# EAGLE design RobotBaseModule (EAGLE 7.3.0)
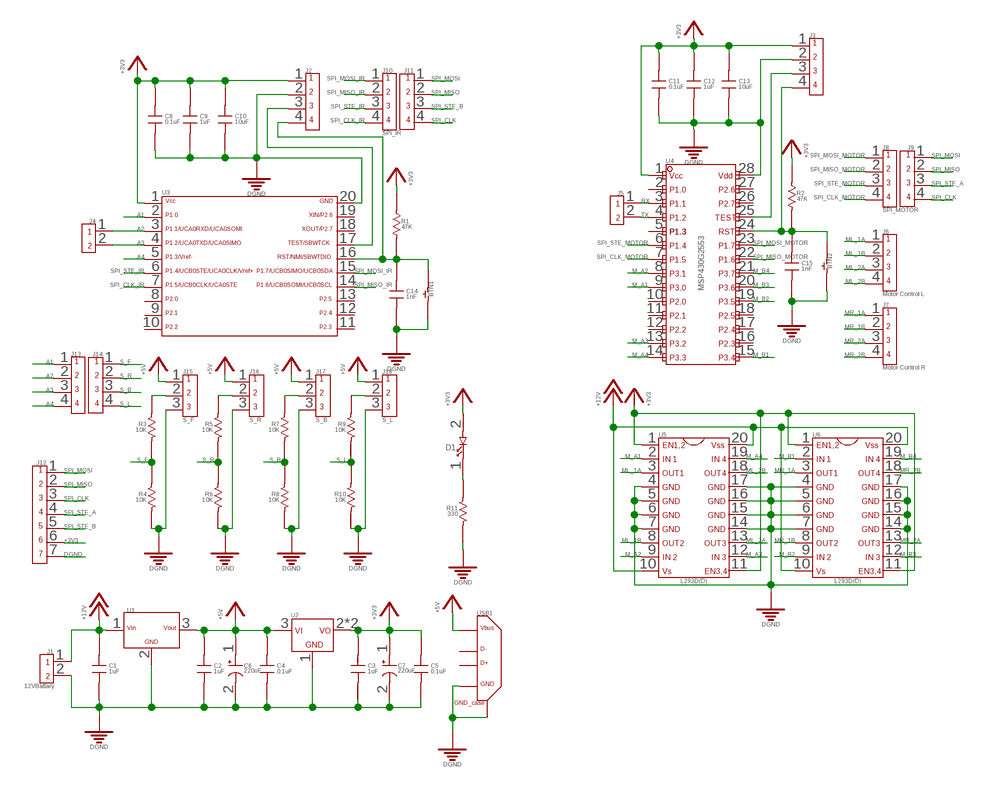
[diagram p0: schematic, sheet 1]

## Parts
BTN1  BTN_NORMAL_OFF_6_3.5_SMD  [BTN_6_3.5_SMD]
BTN2  BTN_NORMAL_OFF_6_3.5_SMD  [BTN_6_3.5_SMD]
C1  1uF  CAPACITOR_FIXED_0805  [0805]
C2  1uF  CAPACITOR_FIXED_0805  [0805]
C3  1uF  CAPACITOR_FIXED_0805  [0805]
C4  0.1uF  CAPACITOR_FIXED_0805  [0805]
C5  0.1uF  CAPACITOR_FIXED_0805  [0805]
C6  220uF  CAPACITOR_POLARIZED_830_830  [CAP_830_830]
C7  220uF  CAPACITOR_POLARIZED_830_830  [CAP_830_830]
C8  0.1uF  CAPACITOR_FIXED_0805  [0805]
C9  1uF  CAPACITOR_FIXED_0805  [0805]
C10  10uF  CAPACITOR_FIXED_0805  [0805]
C11  0.1uF  CAPACITOR_FIXED_0805  [0805]
C12  1uF  CAPACITOR_FIXED_0805  [0805]
C13  10uF  CAPACITOR_FIXED_0805  [0805]
C14  1nF  CAPACITOR_FIXED_0805  [0805]
C15  1nF  CAPACITOR_FIXED_0805  [0805]
D1  LED_0805  [0805DIODE]
J1  12VBattary  2PIN_TERMBLOCK_PITCH5.08MM  [2PIN_TERMBLOCK_PITCH5.08MM]
J2  4PIN_HEADER_VERT_PITCH2.54MM_TH  [4PIN_HEADER_VERT_PITCH2.54MM_TH]
J3  4PIN_HEADER_VERT_PITCH2.54MM_TH  [4PIN_HEADER_VERT_PITCH2.54MM_TH]
J4  2PIN_HEADER_PITCH2.54MM_TH  [2PIN_HEADER_PITCH2.54MM_TH]
J5  2PIN_HEADER_PITCH2.54MM_TH  [2PIN_HEADER_PITCH2.54MM_TH]
J6  Motor Control L  4PIN_HEADER_VERT_PITCH2.54MM_TH  [4PIN_HEADER_VERT_PITCH2.54MM_TH]
J7  Motor Control R  4PIN_HEADER_VERT_PITCH2.54MM_TH  [4PIN_HEADER_VERT_PITCH2.54MM_TH]
J8  SPI_MOTOR  4PIN_HEADER_PITCH2.54MM_TH  [4PIN_HEADER_PITCH2.54MM_TH]
J9  4PIN_HEADER_PITCH2.54MM_TH  [4PIN_HEADER_PITCH2.54MM_TH]
J10  SPI_IR  4PIN_HEADER_PITCH2.54MM_TH  [4PIN_HEADER_PITCH2.54MM_TH]
J11  4PIN_HEADER_PITCH2.54MM_TH  [4PIN_HEADER_PITCH2.54MM_TH]
J12  7PIN_HEADER_VERT_PITCH2.54MM_TH  [7PIN_HEADER_VERT_PITCH2.54MM_TH]
J13  4PIN_HEADER_PITCH2.54MM_TH  [4PIN_HEADER_PITCH2.54MM_TH]
J14  4PIN_HEADER_PITCH2.54MM_TH  [4PIN_HEADER_PITCH2.54MM_TH]
J15  S_F  3PIN_HEADER_VERT_PITCH2.54MM_TH  [3PIN_HEADER_VERT_PITCH2.54MM_TH]
J16  S_R  3PIN_HEADER_VERT_PITCH2.54MM_TH  [3PIN_HEADER_VERT_PITCH2.54MM_TH]
J17  S_B  3PIN_HEADER_VERT_PITCH2.54MM_TH  [3PIN_HEADER_VERT_PITCH2.54MM_TH]
J18  S_L  3PIN_HEADER_VERT_PITCH2.54MM_TH  [3PIN_HEADER_VERT_PITCH2.54MM_TH]
R1  47K  RESISTOR_0805  [0805]
R2  47K  RESISTOR_0805  [0805]
R3  10K  RESISTOR_0805  [0805]
R4  10K  RESISTOR_0805  [0805]
R5  10K  RESISTOR_0805  [0805]
R6  10K  RESISTOR_0805  [0805]
R7  10K  RESISTOR_0805  [0805]
R8  10K  RESISTOR_0805  [0805]
R9  10K  RESISTOR_0805  [0805]
R10  10K  RESISTOR_0805  [0805]
R11  330  RESISTOR_0805  [0805]
U1  V78-2000R  [V78-2000R]
U2  LM1117_SOT-223-4  [SOT-233-4]
U3  MSP430G2X53/G2X13_SSOP20  [SSOP-20]
U4  MSP430G2553  MSP430G2553_24IO_28PIN_TSSOP  [TSSOP-28]
U5  L293D(D)_ST_SMD  [SOIC_20]
U6  L293D(D)_ST_SMD  [SOIC_20]
USB1  USB-1.X/2.0-STANDARDTYPEA-TH  [USB-A-TH]

## Nets
+3V3: C3.1 C5.1 C7.1 C8.1 C9.1 C10.1 C11.1 C12.1 C13.1 D1.2 J2.1 J3.1 J12.6 R1.1 R2.1 U2.2(VOUT) U2.4(VOUT) U3.1 U4.1 U5.1 U5.11 U6.1 U6.11
+5V: C2.1 C4.1 C6.1 J15.1 J16.1 J17.1 J18.1 U1.3(VOUT) U2.3(VIN) USB1.1(VBUS)
+12V: C1.1 J1.1 U1.1(VIN) U5.10 U5.20 U6.10 U6.20
A1: J13.1 U3.2
A2: J4.1 J13.2 U3.3
A3: J4.2 J13.3 U3.4
A4: J13.4 U3.5
DGND: BTN1.2 BTN2.2 C1.2 C2.2 C3.2 C4.2 C5.2 C6.2 C7.2 C8.2 C9.2 C10.2 C11.2 C12.2 C13.2 C14.2 C15.2 J1.2 J2.2 J3.2 J12.7 J15.3 J16.3 J17.3 J18.3 R4.2 R6.2 R8.2 R10.2 R11.2 U1.2(GND) U2.1(GND) U3.20 U4.28 U5.4 U5.5 U5.6 U5.7 U5.14 U5.15 U5.16 U5.17 U6.4 U6.5 U6.6 U6.7 U6.14 U6.15 U6.16 U6.17 USB1.4(GND) USB1.CASE1(GND_CASE) USB1.CASE2(GND_CASE)
M_A1: U4.9 U5.2
M_A2: U4.8 U5.9
M_A3: U4.13 U5.12
M_A4: U4.14 U5.19
M_B1: U4.15 U6.2
M_B2: U4.19 U6.9
M_B3: U4.20 U6.12
M_B4: U4.21 U6.19
ML_1A: J6.1 U5.3
ML_1B: J6.2 U5.8
ML_2A: J6.3 U5.13
ML_2B: J6.4 U5.18
MR_1A: J7.1 U6.3
MR_1B: J7.2 U6.8
MR_2A: J7.3 U6.13
MR_2B: J7.4 U6.18
N$1: J3.3 U4.25
N$2: J2.3 U3.17
N$3: BTN1.1 C14.1 J2.4 R1.2 U3.16
N$4: BTN2.1 C15.1 J3.4 R2.2 U4.24
N$5: J15.2 R3.1
N$6: D1.1 R11.1
N$8: J16.2 R5.1
N$9: J17.2 R7.1
N$10: J18.2 R9.1
RX: J5.1 U4.3
S_B: J14.3 R7.2 R8.1
S_F: J14.1 R3.2 R4.1
S_L: J14.4 R9.2 R10.1
S_R: J14.2 R5.2 R6.1
SPI_CLK: J9.4 J11.4 J12.3
SPI_CLK_IR: J10.4 U3.7
SPI_CLK_MOTOR: J8.4 U4.7
SPI_MISO: J9.2 J11.2 J12.2
SPI_MISO_IR: J10.2 U3.14
SPI_MISO_MOTOR: J8.2 U4.22
SPI_MOSI: J9.1 J11.1 J12.1
SPI_MOSI_IR: J10.1 U3.15
SPI_MOSI_MOTOR: J8.1 U4.23
SPI_STE_A: J9.3 J12.4
SPI_STE_B: J11.3 J12.5
SPI_STE_IR: J10.3 U3.6
SPI_STE_MOTOR: J8.3 U4.6
TX: J5.2 U4.4
Unconnected: U3.8 U3.9 U3.10 U3.11 U3.12 U3.13 U3.18 U3.19 U4.2 U4.5 U4.10 U4.11 U4.12 U4.16 U4.17 U4.18 U4.26 U4.27 USB1.2(D-) USB1.3(D+)

## Library data of the parts
BTN1 BTN2 = Switches:BTN_NORMAL_OFF
C1-C5 C8-C15 = Capacitors:CAPACITOR_FIXED
C6 C7 = Capacitors:CAPACITOR_POLARIZED
D1 = ivani_lib:LED
J1 J4 J5 = Connectors:2PIN
J2 J3 J6-J11 J13 J14 = Connectors:4PIN
J12 = Connectors:7PIN
J15-J18 = Connectors:3PIN
R1-R11 = Resistors:RESISTOR
U1 = Power Supplies:V78-2000
U2 = Power Supplies:LM1117
U3 = MCUs:MSP430G2X53/G2X13
U4 = MCUs:MSP430G2553_24IO_28PIN
U5 U6 = H-Bridges:L293D(D)_ST_SMD
USB1 = Connectors:USB-1.X/2.0-STANDARD

## Board
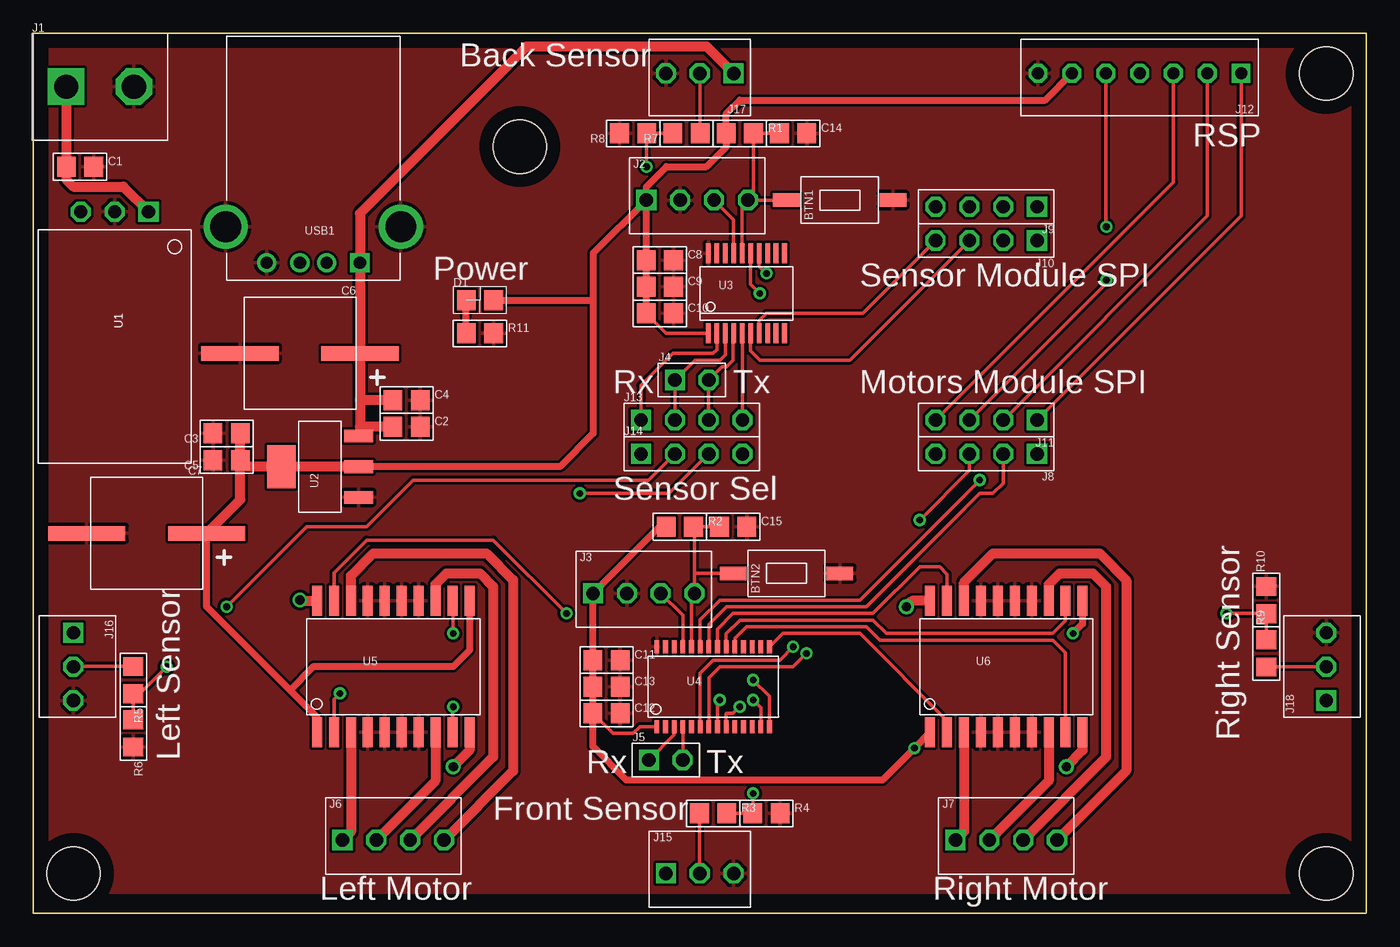
[diagram p1: board, top side]
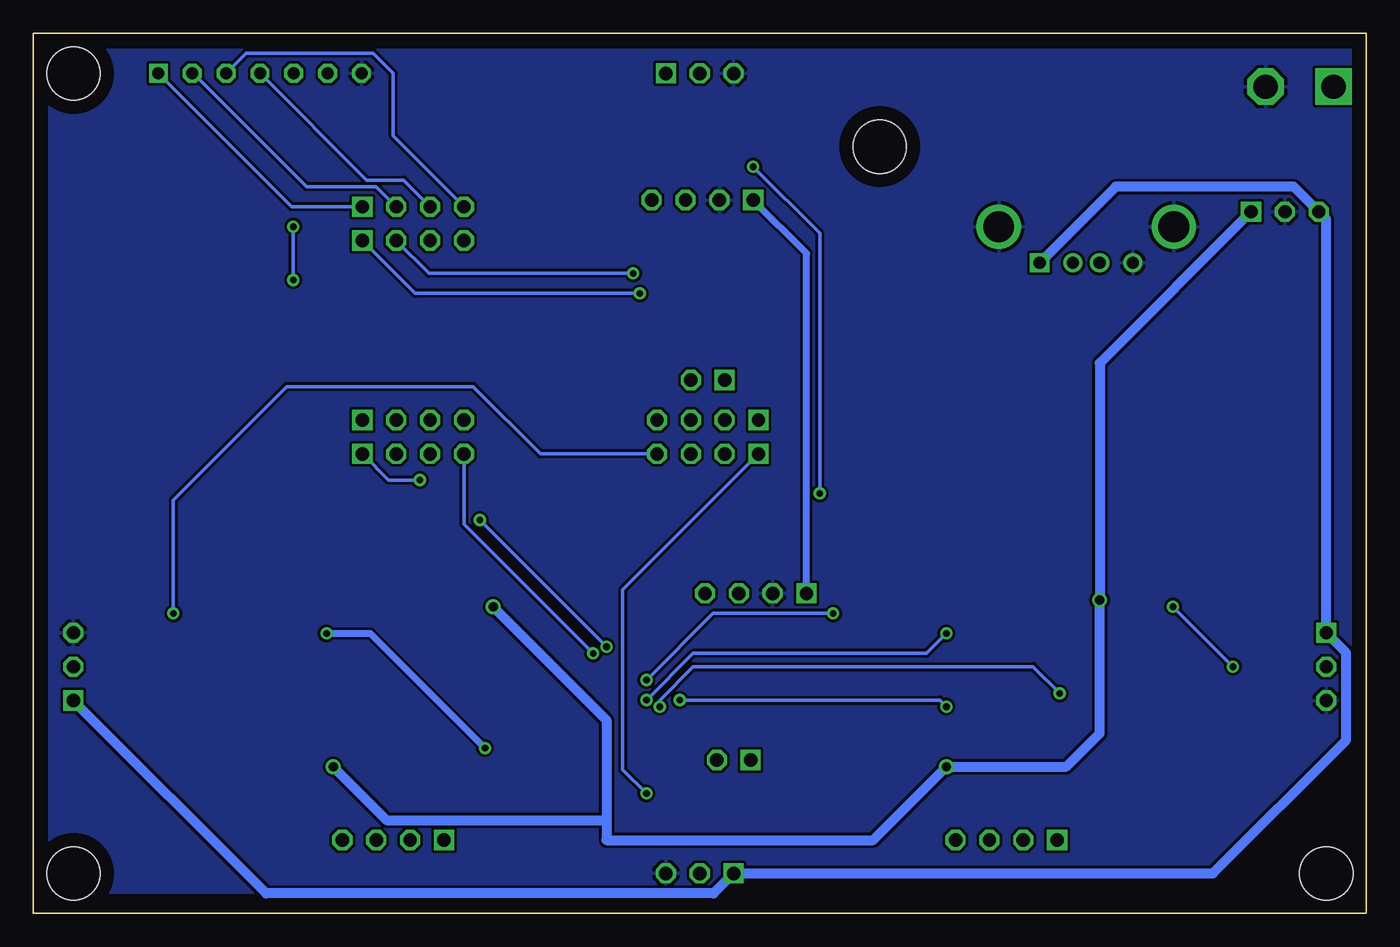
[diagram p2: board, bottom side, seen from below]

Size 100 x 66 mm. Coordinates in mm from the lower left corner, seen from the top.
Outline: 0,0 100,0 100,66 0,66 0,0
Copper layers (1*16): Top 0.035mm / dielectric 1.5mm / Bottom 0.035mm
Design rules "default": minimum track width 10mil, minimum drill 24mil, track to track 8mil, track to pad 8mil, pad to pad 8mil, via to via 8mil, smd to smd 8mil, copper to edge 40mil, drill to drill 8mil, minimum pad ring 10mil, minimum via ring 8mil, stop-mask expansion 4mil, vias tented up to drill 0mil, thermal gap 10mil
Holes 4 mm at 3,3 97,63 97,3 36.5,57.5

### Footprints (pad centres in the part's own frame; a part is rotated, then mirrored left to right if it is on the bottom)
BTN_6_3.5_SMD = smd 1 x 2: 1 0,4; 2 0,-4
0805 = smd 1.4 x 1.5: 1 -1.025,0; 2 1.025,0
CAP_830_830 = smd 5.8 x 1.1: 1 -4.5,0; 2 4.5,0
0805DIODE = smd 1.4 x 1.5: 1 -1.025,0; 2 1.025,0
2PIN_TERMBLOCK_PITCH5.08MM = drill 1.82 square: 1 -2.54,0 | drill 1.82 octagon: 2 2.54,0
4PIN_HEADER_VERT_PITCH2.54MM_TH = drill 1 square: 1 -3.81,0 | drill 1 octagon: 2 -1.27,0; 3 1.27,0; 4 3.81,0
2PIN_HEADER_PITCH2.54MM_TH = drill 1 square: 1 -1.27,0 | drill 1 octagon: 2 1.27,0
4PIN_HEADER_PITCH2.54MM_TH = drill 1 square: 1 -3.81,0 | drill 1 octagon: 2 -1.27,0; 3 1.27,0; 4 3.81,0
7PIN_HEADER_VERT_PITCH2.54MM_TH = drill 0.9 square: 1 -7.62,0 | drill 0.9 octagon: 2 -5.08,0; 3 -2.54,0; 4 0,0; 5 2.54,0; 6 5.08,0; 7 7.62,0
3PIN_HEADER_VERT_PITCH2.54MM_TH = drill 1 square: 1 -2.54,0 | drill 1 octagon: 2 0,0; 3 2.54,0
V78-2000R = drill 1 square: 1 -7.62,2.54 | drill 1 octagon: 2 -7.62,0; 3 -7.62,-2.54
SOT-233-4 = smd 0.95 x 2.15: 1 -2.3,-2.9; 2 0,-2.9; 3 2.3,-2.9 | smd 3.25 x 2.15: 4 0,2.9
SSOP-20 = smd 0.35 x 1.5: 1 -2.857,-3; 2 -2.223,-3; 3 -1.587,-3; 4 -0.953,-3; 5 -0.318,-3; 6 0.318,-3; 7 0.953,-3; 8 1.587,-3; 9 2.223,-3; 10 2.857,-3; 11 2.857,3; 12 2.223,3; 13 1.587,3; 14 0.953,3; 15 0.318,3; 16 -0.318,3; 17 -0.953,3; 18 -1.587,3; 19 -2.223,3; 20 -2.857,3
TSSOP-28 = smd 0.35 x 1: 1 -4.225,-3; 2 -3.575,-3; 3 -2.925,-3; 4 -2.275,-3; 5 -1.625,-3; 6 -0.975,-3; 7 -0.325,-3; 8 0.325,-3; 9 0.975,-3; 10 1.625,-3; 11 2.275,-3; 12 2.925,-3; 13 3.575,-3; 14 4.225,-3; 15 4.225,3; 16 3.575,3; 17 2.925,3; 18 2.275,3; 19 1.625,3; 20 0.975,3; 21 0.325,3; 22 -0.325,3; 23 -0.975,3; 24 -1.625,3; 25 -2.275,3; 26 -2.925,3; 27 -3.575,3; 28 -4.225,3
SOIC_20 = smd 0.75 x 2.25: 1 -5.715,-4.935; 2 -4.445,-4.935; 3 -3.175,-4.935; 4 -1.905,-4.935; 5 -0.635,-4.935; 6 0.635,-4.935; 7 1.905,-4.935; 8 3.175,-4.935; 9 4.445,-4.935; 10 5.715,-4.935; 11 5.715,4.935; 12 4.445,4.935; 13 3.175,4.935; 14 1.905,4.935; 15 0.635,4.935; 16 -0.635,4.935; 17 -1.905,4.935; 18 -3.175,4.935; 19 -4.445,4.935; 20 -5.715,4.935
USB-A-TH = drill 0.92 square: 1 -3.5,2.71 | drill 0.92: 2 -1,2.71; 3 1,2.71; 4 3.5,2.71 | drill 2.3: CASE1 -6.57,0; CASE2 6.57,0

### Placement (x,y rotation side)
BTN1  60.5,53.5 90 top
BTN2  56.5,25.5 90 top
C1  3.5,56 0 top
C2  28,36.5 0 top
C3  14.5,36 180 top
C4  28,38.5 0 top
C5  14.5,34 180 top
C6  20,42 180 top
C7  8.5,28.5 180 top
C8  47,49 0 top
C9  47,47 0 top
C10  47,45 0 top
C11  43,19 0 top
C12  43,15 0 top
C13  43,17 0 top
C14  57,58.5 0 top
C15  52.5,29 0 top
D1  33.5,46 0 top
J1  5,62 0 top
J2  49.8,53.5 0 top
J3  45.8,24 0 top
J4  49.4,40 0 top
J5  47.45,11.5 0 top
J6  27,5.5 0 top
J7  73,5.5 0 top
J8  71.5,34.46 180 top
J9  71.5,53 180 top
J10  71.5,50.46 180 top
J11  71.5,37 180 top
J12  83,63 180 top
J13  49.4,37 0 top
J14  49.4,34.46 0 top
J15  50,3 0 top
J16  3,18.5 270 top
J17  50,63 180 top
J18  97,18.5 90 top
R1  53,58.5 0 top
R2  48.5,29 0 top
R3  51,7.5 0 top
R4  55,7.5 0 top
R5  7.5,17.5 270 top
R6  7.5,13.5 270 top
R7  49,58.5 180 top
R8  45,58.5 180 top
R9  92.5,19.5 90 top
R10  92.5,23.5 90 top
R11  33.5,43.5 0 top
U1  6.1,45 270 top
U2  21.5,33.5 90 top
U3  53.5,46.5 0 top
U4  51,17 0 top
U5  27,18.5 0 top
U6  73,18.5 0 top
USB1  21,51.5 180 top

### Tracks (layer width: path | path; a pad name or v marks a point on that pad's centre or on a via)
+3V3  (via drill 0.5)
  Top 0.254: U3.1 47.48,43.5 C10.1 | 45.98,53.48 J2.1 | U4.1 45.5,14 45,13.5 43.48,13.5 C12.1
  Top 0.508: J2.1 45.99,54.49 47.5,56 50.5,56 52,57.5 52,58.48 R1.1 51.98,59.98 53,61 75.92,61 J12.6 | C10.1 C9.1 C8.1 45.99,49.02 J2.1 | U5.1 21.29,14.71 19.25,16.75 | 19.25,16.75 13,23 C7.1 | U5.11 32.72,19.71 31.5,18.5 21,18.5 19.25,16.75 | R2.1 46.99,29 J3.1 41.98,23.98 C11.1 C13.1 C12.1 41.98,12.53 44.5,10 63.72,10 v66.11,12.39 U6.1 | J2.1 42,49.51 42,46 | 42,46 42,36 39.5,33.5 U2.2 | U6.11 78.72,21.71 v78,21 | D1.2 42,46
  Top 0.762: U2.2 U2.4 16.02,33.5 C5.1 | C5.1 C3.1 | C7.1 15.53,31.02 C5.1
  Bottom 0.508: J3.1 41.99,49.5 J2.1 | v78,21 74.72,21 v66.11,12.39
+5V
  Top 0.762: 24.5,38.5 C6.1 USB1.1 24.5,52.5 37,65 50.54,65 J17.1 | 24.5,38.5 24.5,36.5 | 24.5,36.5 24.5,35.9 U2.3 | C4.1 24.5,38.5 | C2.1 24.5,36.5
  Bottom 0.762: USB1.1 18.79,54.5 5.44,54.5 U1.3 3,52.06 J16.1 1.5,19.54 1.5,13 11.5,3 J15.1 48.96,1.5 82.54,1.5 J18.1
+12V  (via drill 0.7)
  Top 0.762: J1.1 2.46,56.02 C1.1 2.48,55.02 3,54.5 6.76,54.5 U1.1 | v20,23.5 20.07,23.43 U5.20 | U5.10 32.72,12.21 v31.5,11 | U6.20 65.94,23.43 v65.5,23 | U6.10 78.72,12.21 v77.5,11
  Bottom 0.762: U1.1 20,41.26 v20,23.5 20,13.5 22.5,11 v31.5,11 37,5.5 57,5.5 57,7 | v65.5,23 57,14.5 57,7 | v77.5,11 73.5,7 57,7
A1
  Top 0.254: U3.2 51.28,42.28 51,42 48,42 45.59,39.59 J13.1
A2
  Top 0.254: U3.3 51.91,41.91 51.5,41.5 49.63,41.5 J4.1 J13.2
A3
  Top 0.254: J13.3 J4.2 51.67,41 52,41 52.5,41.5 52.5,43.45 U3.4
A4
  Top 0.254: J13.4 53.21,43.47 U3.5
DGND
  pour Bottom: 1,65 1,1.5 99,1.5 99,65
  pour Top: 1,65 1,1.5 99,1.5 99,65
M_A1  (via drill 0.5)
  Top 0.254: v23,16.5 22.55,16.05 U5.2 | U4.9 51.98,14.97 52,15 52.5,15 v53,15.5
  Bottom 0.254: v23,16.5 25,18.5 50.5,18.5 53,16 v53,15.5
M_A2  (via drill 0.5)
  Top 0.254: U4.8 51.33,15.82 v51.5,16 | v31.5,15.5 31.45,15.45 U5.9
  Bottom 0.254: v51.5,16 32,16 v31.5,15.5
M_A3  (via drill 0.5)
  Top 0.254: v54,16 54.58,15.43 U4.13 | U5.12 31.5,23.38 v31.5,21
  Bottom 0.254: v54,16 50.5,19.5 33,19.5 v31.5,21
M_A4  (via drill 0.5)
  Top 0.254: U5.19 22.55,25.55 25,28 34.5,28 v40,22.5 | v54,17.5 55.23,16.27 U4.14
  Bottom 0.254: v40,22.5 49,22.5 v54,17.5
M_B1
  Top 0.254: U4.15 56.23,21 62,21 68.56,14.45 U6.2
M_B2
  Top 0.254: U4.19 52.62,20.62 53.5,21.5 62.5,21.5 63.5,20.5 76.5,20.5 77.44,19.55 U6.9
M_B3
  Top 0.254: U4.20 51.98,20.98 53,22 63,22 64,21 76.5,21 77.44,21.95 U6.12
M_B4
  Top 0.254: U6.19 68.56,25.45 68,26 66.5,26 63,22.5 52.5,22.5 51.33,21.32 U4.21
ML_1A
  Top 0.762: U5.3 23.82,6.13 J6.1
ML_1B
  Top 0.762: U5.8 30.18,9.95 J6.2
ML_2A
  Top 0.762: U5.13 30.18,24.68 31,25.5 33.5,25.5 34.5,24.5 34.5,11.73 J6.3
ML_2B
  Top 0.762: U5.18 23.82,25.32 25.5,27 34,27 36,25 36,10.69 J6.4
MR_1A
  Top 0.762: U6.3 69.83,6.13 J7.1
MR_1B
  Top 0.762: U6.8 76.17,9.95 J7.2
MR_2A
  Top 0.762: J7.3 80.5,11.73 80.5,24.5 79.5,25.5 77,25.5 76.17,24.68 U6.13
MR_2B
  Top 0.762: U6.18 69.83,24.82 72,27 80,27 82,25 82,10.69 J7.4
N$1
  Top 0.254: U4.25 48.73,22.34 J3.3
N$2
  Top 0.254: U3.17 52.55,52.02 J2.3
N$3
  Top 0.254: U3.16 53.18,53.07 J2.4 | J2.4 BTN1.1 | C14.1 R1.2 54.02,53.91 J2.4
N$4
  Top 0.254: U4.24 49.38,23.77 J3.4 49.61,25.5 | C15.1 R2.2 49.61,28.91 49.61,25.5 | BTN2.1 49.61,25.5
N$5
  Top 0.254: R3.1 49.98,3.02 J15.2
N$6
  Top 0.508: R11.1 D1.1
N$8
  Top 0.254: R5.1 3.02,18.52 J16.2
N$9
  Top 0.254: R7.1 50.02,62.98 J17.2
N$10
  Top 0.254: J18.2 92.53,18.5 R9.1
RX
  Top 0.254: U4.3 48.08,13.39 J5.1
S_B  (via drill 0.5)
  Top 0.254: R7.2 R8.1 46,58.48 v46,56 | J14.3 47.71,31.5 v41,31.5
  Bottom 0.254: v41,31.5 41,51 v46,56
S_F  (via drill 0.5)
  Top 0.254: R3.2 R4.1 | 54.18,7.61 R4.1 | v54,9 54,7.53 R4.1
  Bottom 0.254: v54,9 55.78,10.78 55.78,24.27 J14.1
S_L  (via drill 0.5)
  Top 0.254: R9.2 R10.1 92.47,22.5 v89.5,22.5
  Bottom 0.254: J14.4 61.96,34.46 67,39.5 81,39.5 89.5,31 v89.5,22.5
S_R  (via drill 0.5)
  Top 0.254: R6.1 R5.2 8,16.48 8,16.5 v10,18.5 | J14.2 46.17,32.5 28.5,32.5 25,29 20.5,29 v14.5,23
  Bottom 0.254: v14.5,23 v10,18.5
SPI_CLK
  Top 0.254: J11.4 85.54,54.85 J12.3
  Bottom 0.254: J9.4 73,58.31 73,63 74.5,64.5 84.04,64.5 J12.3
SPI_CLK_IR
  Top 0.254: U3.7 54.45,44.45 55,45 62.23,45 J10.4
SPI_CLK_MOTOR  (via drill 0.5)
  Top 0.254: U4.7 50.67,17.68 51.5,18.5 57,18.5 v58,19.5
  Bottom 0.254: v58,19.5 67.69,29.19 J8.4
SPI_MISO
  Top 0.254: J11.2 88.08,52.31 J12.2
  Bottom 0.254: J9.2 74.27,54.5 79.5,54.5 88.08,63.08 J12.2
SPI_MISO_IR  (via drill 0.5)
  Top 0.254: U3.14 54.45,48.55 v55,48
  Bottom 0.254: v55,48 70.31,48 J10.2
SPI_MISO_MOTOR
  Top 0.254: J8.2 72.77,32.27 72,31.5 71,31.5 62.5,23 52,23 50.67,21.68 U4.22
SPI_MOSI
  Top 0.254: J11.1 90.62,52.31 J12.1
  Bottom 0.254: J9.1 80.62,53 J12.1
SPI_MOSI_IR  (via drill 0.5)
  Top 0.254: U3.15 53.82,47.18 v54.5,46.5
  Bottom 0.254: v54.5,46.5 71.35,46.5 J10.1
SPI_MOSI_MOTOR  (via drill 0.5)
  Top 0.254: v71,32.5 62,23.5 51.5,23.5 50.02,22.02 U4.23
  Bottom 0.254: v71,32.5 73.35,32.5 J8.1
SPI_STE_A
  Bottom 0.254: J12.4 75,55 72.23,55 J9.3
SPI_STE_B  (via drill 0.5)
  Top 0.254: J11.3 80.5,47.27 v80.5,47.5 | v80.5,51.5 80.46,51.54 J12.5
  Bottom 0.254: v80.5,47.5 v80.5,51.5
SPI_STE_IR
  Top 0.254: U3.6 53.82,42.18 54.5,41.5 61.27,41.5 J10.3
SPI_STE_MOTOR  (via drill 0.5)
  Top 0.254: U4.6 50.02,18.02 51,19 56,19 v57,20 | v66.5,29.5 70.23,33.23 J8.3
  Bottom 0.254: v57,20 v66.5,29.5
TX
  Top 0.254: U4.4 J5.2

### Text on the board
tPlace: Back Sensor | RSP | Power | Sensor Module SPI | Rx | Tx | Motors Module SPI | Sensor Sel | Right Sensor | Left Sensor | Rx | Tx | Front Sensor | Left Motor | Right Motor